# EAGLE design Natcar (EAGLE 9.2.2)
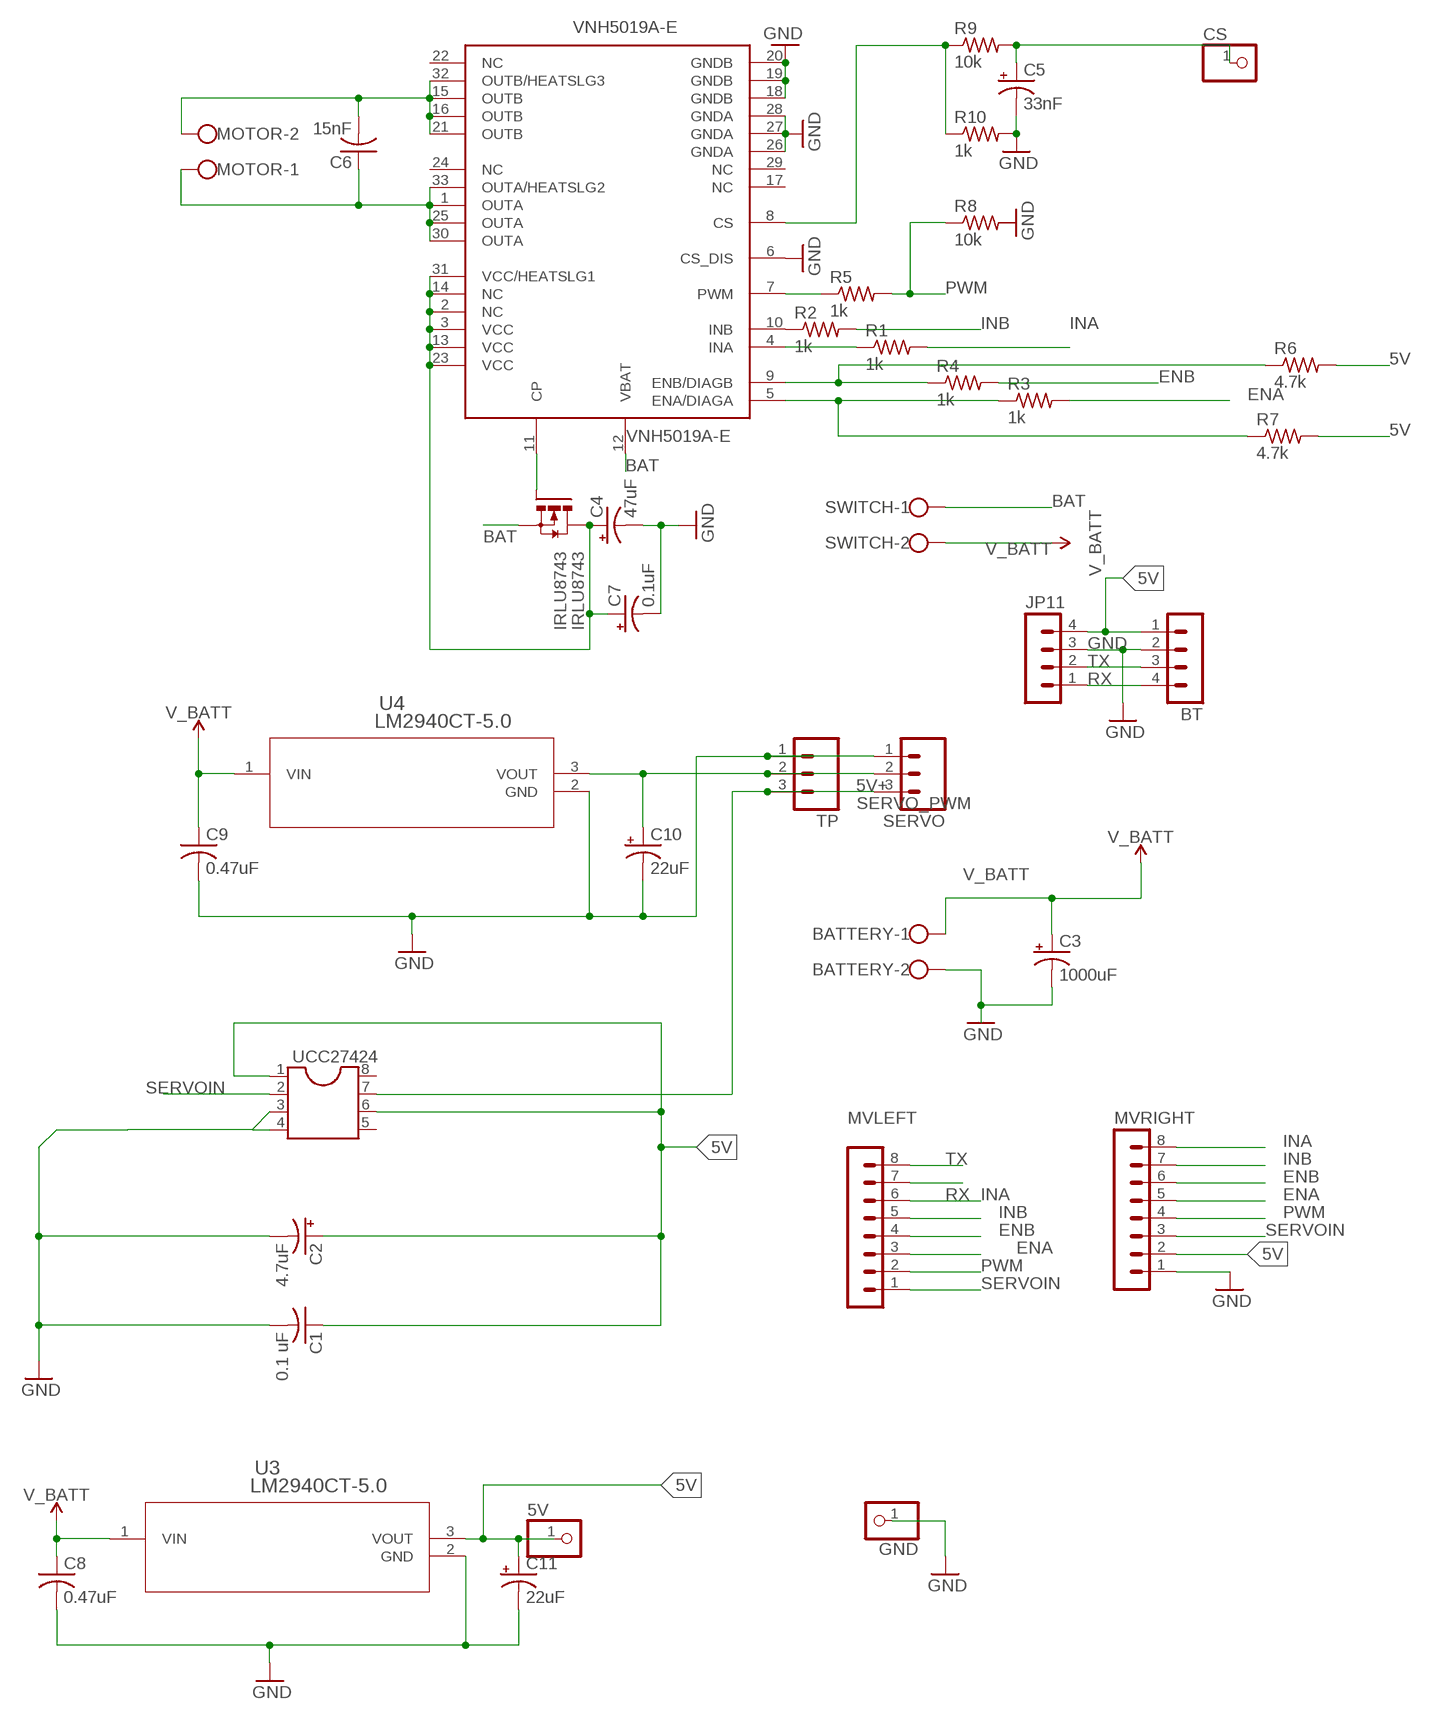
[diagram p0: schematic, sheet 1]

## Parts
5V  PINHD-1X1  [1X01]
BATTERY  W237-102  [W237-102]
BT  MA04-1  [MA04-1]
C1  0.1 uF  C-US025-030X050  [C025-030X050]
C2  4.7uF  CPOL-USE2-5  [E2-5]
C3  1000uF  CPOL-USE5-10.5  [E5-10,5]
C4  47uF  CPOL-USE2.5-5  [E2,5-5]
C5  33nF  CPOL-USE2.5-5  [E2,5-5]
C6  15nF  C-US025-025X050  [C025-025X050]
C7  0.1uF  CPOL-USE2.5-5  [E2,5-5]
C8  0.47uF  C-US025-030X050  [C025-030X050]
C9  0.47uF  C-US025-030X050  [C025-030X050]
C10  22uF  CPOL-USE2.5-5  [E2,5-5]
C11  22uF  CPOL-USE2.5-5  [E2,5-5]
CS  PINHD-1X1  [1X01]
GND  PINHD-1X1  [1X01]
IRLU8743  IRLU8743  [TO251AA-V]
JP11  MA04-1  [MA04-1]
MOTOR  W237-102  [W237-102]
MVLEFT  MA08-1  [MA08-1]
MVRIGHT  MA08-1  [MA08-1]
R1  1k  R-US_0207/7  [0207/7]
R2  1k  R-US_0207/7  [0207/7]
R3  1k  R-US_0207/7  [0207/7]
R4  1k  R-US_0207/7  [0207/7]
R5  1k  R-US_0207/7  [0207/7]
R6  4.7k  R-US_0207/7  [0207/7]
R7  4.7k  R-US_0207/7  [0207/7]
R8  10k  R-US_0207/7  [0207/7]
R9  10k  R-US_0207/7  [0207/7]
R10  1k  R-US_0207/7  [0207/7]
SERVO  MA03  [03P]
SWITCH  W237-102  [W237-102]
TP  MA03  [03P]
U3  LM2940CT-5.0  [T03B]
U4  LM2940CT-5.0  [T03B]
UCC27424  DIL8S  [SOCKET-08]
VNH5019A-E  VNH5019A-E  [MULTIPOWERSO-30]

## Nets
5V: 5V.1 BT.1 C1.1 C2.+ C11.+ JP11.4 MVRIGHT.2 R6.2 R7.2 U3.3(VOUT) UCC27424.1 UCC27424.6
5V+: C10.+ SERVO.2 TP.2 U4.3(VOUT)
BAT: IRLU8743.3(S) SWITCH.1 VNH5019A-E.12(VBAT)
ENA: MVLEFT.3 MVRIGHT.5 R3.2
ENB: MVLEFT.4 MVRIGHT.6 R4.2
GND: BATTERY.2 BT.2 C1.2 C2.- C3.- C4.- C5.- C7.- C8.2 C9.2 C10.- C11.- GND.1 JP11.3 MVRIGHT.1 R10.2 SERVO.1 TP.1 U3.2(GND) U4.2(GND) UCC27424.3 UCC27424.4 VNH5019A-E.6(CS_DIS) VNH5019A-E.18(GNDB) VNH5019A-E.19(GNDB) VNH5019A-E.20(GNDB) VNH5019A-E.26(GNDA) VNH5019A-E.27(GNDA) VNH5019A-E.28(GNDA)
INA: MVLEFT.6 MVRIGHT.8 R1.2
INB: MVLEFT.5 MVRIGHT.7 R2.2
N$1: R9.1 R10.1 VNH5019A-E.8(CS)
N$2: R1.1 VNH5019A-E.4(INA)
N$3: R2.1 VNH5019A-E.10(INB)
N$4: R3.1 R7.1 VNH5019A-E.5(ENA/DIAGA)
N$5: R4.1 R6.1 VNH5019A-E.9(ENB/DIAGB)
N$6: R5.1 VNH5019A-E.7(PWM)
N$8: C5.+ CS.1 R9.2
N$21: IRLU8743.1(G) VNH5019A-E.11(CP)
OUTA [default]: C6.1 MOTOR.1 VNH5019A-E.1(OUTA) VNH5019A-E.25(OUTA) VNH5019A-E.30(OUTA) VNH5019A-E.33(OUTA/HEATSLG2)
OUTB [default]: C6.2 MOTOR.2 VNH5019A-E.15(OUTB) VNH5019A-E.16(OUTB) VNH5019A-E.21(OUTB) VNH5019A-E.32(OUTB/HEATSLG3)
PWM: MVLEFT.2 MVRIGHT.4 R5.2 R8.1
RX: BT.4 JP11.1 MVLEFT.7
SERVO_PWM: SERVO.3 TP.3 UCC27424.7
SERVOIN: MVLEFT.1 MVRIGHT.3 UCC27424.2
TX: BT.3 JP11.2 MVLEFT.8
V_BATT [Power]: BATTERY.1 C3.+ C8.1 C9.1 SWITCH.2 U3.1(VIN) U4.1(VIN)
VCC: C4.+ C7.+ IRLU8743.2(D) VNH5019A-E.2(NC) VNH5019A-E.3(VCC) VNH5019A-E.13(VCC) VNH5019A-E.14(NC) VNH5019A-E.23(VCC) VNH5019A-E.31(VCC/HEATSLG1)
Unconnected: R8.2 UCC27424.5 UCC27424.8 VNH5019A-E.17(NC) VNH5019A-E.22(NC) VNH5019A-E.24(NC) VNH5019A-E.29(NC)

## Library data of the parts
5V CS GND = pinhead:PINHD-1X1: PIN HEADER
BATTERY MOTOR SWITCH = con-wago-500:W237-102: WAGO SCREW CLAMP; MPN: 237-102; OC_FARNELL: unknown; OC_NEWARK: 70K9898
BT JP11 = con-lstb:MA04-1: PIN HEADER; OC_FARNELL: unknown; OC_NEWARK: unknown
C1 = adafruit:C-US: CAPACITOR, American symbol
C2 C3 C10 C11 = adafruit:CPOL-US: POLARIZED CAPACITOR, American symbol
C4 C5 C7 = rcl:CPOL-US: POLARIZED CAPACITOR, American symbol; SPICEPREFIX: C
C6 = resistor:C-US: CAPACITOR, American symbol
C8 C9 = rcl:C-US: CAPACITOR, American symbol; SPICEPREFIX: C
IRLU8743 = irlu8743:IRLU8743
MVLEFT MVRIGHT = con-lstb:MA08-1: PIN HEADER; OC_FARNELL: unknown; OC_NEWARK: unknown
R1-R10 = rcl:R-US_: RESISTOR, American symbol; SPICEPREFIX: R
SERVO TP = con-amp-quick:MA03: AMP QUICK CONNECTOR; OC_FARNELL: unknown; OC_NEWARK: unknown
U3 U4 = lm2940ct:LM2940CT-5.0; MANUFACTURER_PART_NUMBER: LM2940CT5.0; VENDOR: Texas Instruments
UCC27424 = ic-package:DIL8: Dual In Line / Socket
VNH5019A-E = VNH5019A-E:VNH5019A-E

## Net classes
0 Control: width 0.254 mm, drill 0.508 mm, clearance 0.305 mm
1 Power: width 1.016 mm, drill 0.508 mm, clearance 0.305 mm
2 default: width 0.254 mm, drill 0.508 mm, clearance 0.305 mm

## Board
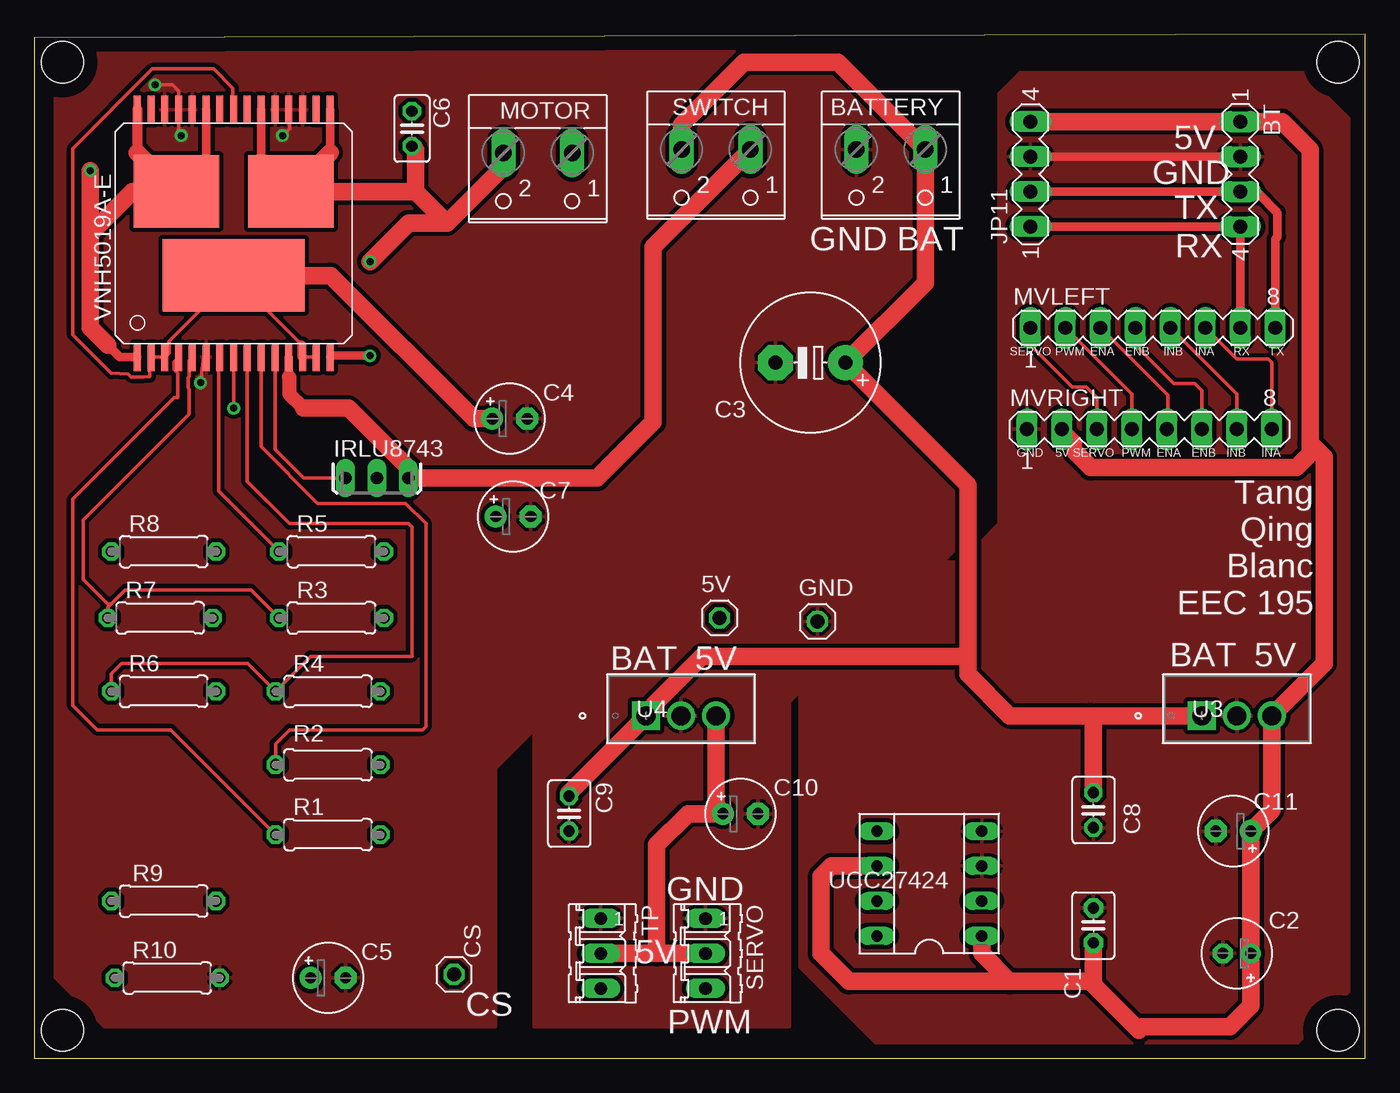
[diagram p1: board, top side]
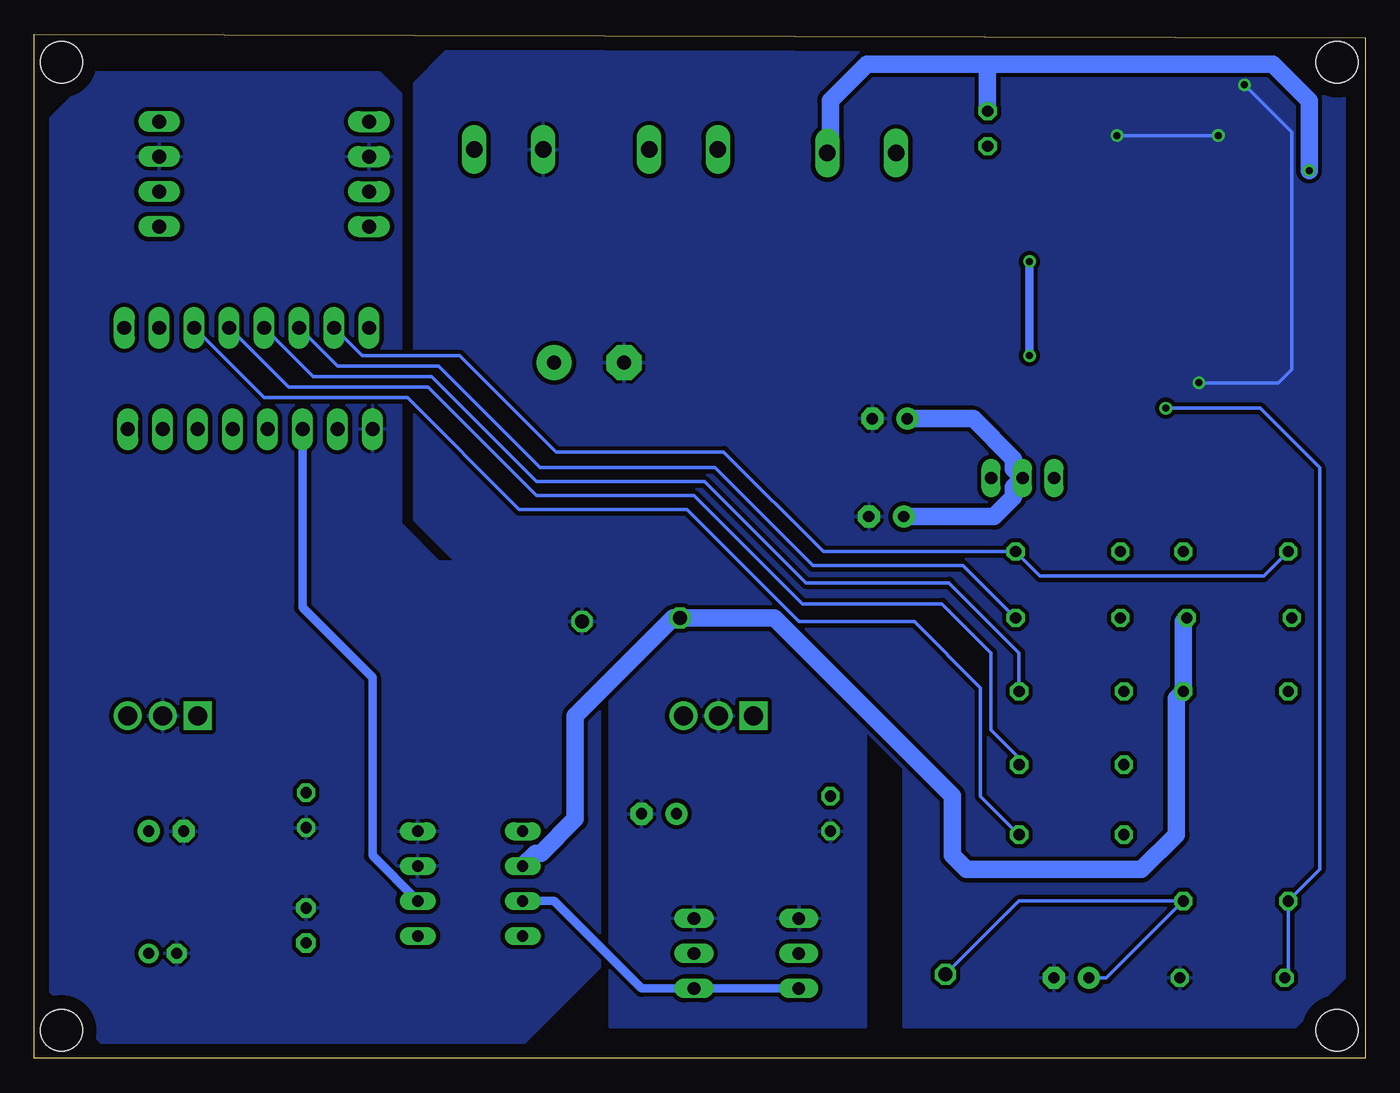
[diagram p2: board, bottom side, seen from below]

Size 96.7 x 74.41 mm. Coordinates in mm from the lower left corner, seen from the top.
Outline: 0,0 96.7,0 96.7,74.41 0,74.16 0,0
Copper layers (1*16): Top 0.035mm / dielectric 1.5mm / Bottom 0.035mm
Design rules "default": minimum track width 6mil, minimum drill 0.35mm, track to track 6mil, track to pad 6mil, pad to pad 6mil, via to via 6mil, smd to smd 6mil, copper to edge 40mil, drill to drill 6mil, minimum pad ring 10mil, minimum via ring 8mil, stop-mask expansion 4mil, vias tented up to drill 0mil, thermal gap 10mil
Holes 3.05 mm at 2.03,72.39 94.74,72.39 94.74,2.03 2.03,2.03

### Footprints (pad centres in the part's own frame; a part is rotated, then mirrored left to right if it is on the bottom)
1X01 = drill 1.016 octagon: 1 0,0
W237-102 = drill 1.194 long: 1 -2.5,-1.27; 2 2.5,-1.27
MA04-1 = drill 1.016 long: 1 -3.81,0; 2 -1.27,0; 3 1.27,0; 4 3.81,0
C025-030X050 = drill 0.813 pad 1.422 octagon: 1 -1.27,0; 2 1.27,0
E2-5 = drill 0.813 pad 1.422: + -1.016,0 | drill 0.813 pad 1.422 octagon: - 1.016,0
E5-10,5 = drill 1.016 pad 2.54: + -2.54,0 | drill 1.016 pad 2.54 octagon: - 2.54,0
E2,5-5 = drill 0.813 pad 1.6: + -1.27,0 | drill 0.813 pad 1.6 octagon: - 1.27,0
C025-025X050 = drill 0.813 octagon: 1 -1.27,0; 2 1.27,0
C025-030X050' = drill 0.813 octagon: 1 -1.27,0; 2 1.27,0
TO251AA-V = drill 0.889 long: 1 -2.286,0; 2 0,0; 3 2.286,0
MA08-1 = drill 1.016 long: 1 -8.89,0; 2 -6.35,0; 3 -3.81,0; 4 -1.27,0; 5 1.27,0; 6 3.81,0; 7 6.35,0; 8 8.89,0
0207/7 = drill 0.813 octagon: 1 -3.81,0; 2 3.81,0
03P = drill 0.914 long: 1 -2.54,0; 2 0,0; 3 2.54,0
T03B = drill 1.372 pad 1.88 square: 1 -5.08,-1.016 | drill 1.372 pad 1.88: 2 -2.54,-1.016; 3 0,-1.016
SOCKET-08 = drill 0.813 long: 1 -3.81,-3.81; 2 -1.27,-3.81; 3 1.27,-3.81; 4 3.81,-3.81; 5 3.81,3.81; 6 1.27,3.81; 7 -1.27,3.81; 8 -3.81,3.81
MULTIPOWERSO-30 = smd 0.508 x 2: 1 -7,-9; 2 -6,-9; 3 -5,-9; 4 -4,-9; 5 -3,-9; 6 -2,-9; 7 -1,-9; 8 0,-9; 9 1,-9; 10 2,-9; 11 3,-9; 12 4,-9; 13 5,-9; 14 6,-9; 15 7,-9; 16 7,9; 17 6,9; 18 5,9; 19 4,9; 20 3,9; 21 2,9; 22 1,9; 23 0,9; 24 -1,9; 25 -2,9; 26 -3,9; 27 -4,9; 28 -5,9; 29 -6,9; 30 -7,9 | smd 10.3 x 5.25: 31 0,-3.05 | smd 6.23 x 5.25: 32 4.165,3.05; 33 -4.165,3.05

### Placement (x,y rotation side)
5V  49.78,32 0 top
BATTERY  62.23,64.77 180 top
BT  87.63,64.26 270 top
C1  76.96,9.65 90 top
C2  87.38,7.62 180 top
C3  56.39,50.55 180 top
C4  34.54,46.48 0 top
C5  21.34,5.84 0 top
C6  27.43,67.56 270 top
C7  34.8,39.37 0 top
C8  0.47uF  [C025-030X050']  76.96,18.03 270 top
C9  0.47uF  [C025-030X050']  38.86,17.78 270 top
C10  51.31,17.78 0 top
C11  87.12,16.51 180 top
CS  30.48,6.1 0 top
GND  56.9,31.75 0 top
IRLU8743  24.89,42.16 0 top
JP11  72.39,64.26 90 top
MOTOR  36.58,64.52 180 top
MVLEFT  81.28,53.09 0 top
MVRIGHT  81.03,45.72 0 top
R1  21.34,16.26 0 top
R2  21.34,21.34 0 top
R3  21.59,32 0 top
R4  21.34,26.67 0 top
R5  21.59,36.83 0 top
R6  9.4,26.67 0 top
R7  9.14,32 0 top
R8  9.4,36.83 0 top
R9  9.4,11.43 0 top
R10  9.65,5.84 0 top
SERVO  48.77,7.62 270 top
SWITCH  49.53,64.77 180 top
TP  41.15,7.62 270 top
U3  89.92,25.91 0 top
U4  49.53,25.91 0 top
UCC27424  65.02,12.7 90 top
VNH5019A-E  14.48,59.94 0 top

### Tracks (layer width: path | path; a pad name or v marks a point on that pad's centre or on a via)
5V
  Top 1.016: 75.64,44.05 75.64,44.76 MVRIGHT.2
  Top 1.27: JP11.4 BT.1 90.68,68.07 92.71,66.04 92.71,44.7 | 92.71,44.7 92.71,43.94 91.69,42.93 76.77,42.93 75.64,44.05 | 92.71,44.7 93.73,43.69 93.73,28.7 U3.3 89.92,18.03 C11.+ C2.+ 88.39,3.81 86.87,2.29 80.52,2.29 80.26,2.03 76.96,5.33 | 76.96,5.33 C1.1 | 76.96,5.33 76.71,5.59 70.87,5.59 | 70.87,5.59 68.83,7.62 UCC27424.1 | 70.87,5.59 59.18,5.59 57.15,7.62 57.15,13.21 57.91,13.97 UCC27424.6
  Bottom 1.27: UCC27424.6 60.27,14.91 59.89,14.91 57.4,17.4 57.4,24.89 50.29,32 5V.1 42.91,32 29.97,19.07 29.97,14.73 28.96,13.72 16.26,13.72 13.72,16.26 13.72,26.16 R6.2 13.21,31.75 R7.2
5V+
  Top 1.27: SERVO.2 45.21,7.62 | U4.3 49.53,18.29 C10.+ 47.5,17.78 45.21,15.49 45.21,7.62 | 45.21,7.62 TP.2
BAT
  Top 0.61: VNH5019A-E.12 18.48,49.54
  Top 1.016: 19.56,47.24 18.52,48.28 18.52,49.5 18.48,49.54
  Top 1.27: SWITCH.1 44.96,58.97 44.96,46.23 40.89,42.16 IRLU8743.3 27.18,42.89 22.83,47.24 19.56,47.24
ENA
  Top 0.254: MVLEFT.3 82.35,48.21 82.35,45.77 MVRIGHT.5
  Bottom 0.254: MVLEFT.3 74.68,50.29 67.31,50.29 59.94,42.93 47.24,42.93 40.13,35.81 29.21,35.81 R3.2
ENB
  Top 0.254: MVLEFT.4 80.01,51.82 82.8,49.02 84.33,49.02 84.84,48.51 MVRIGHT.6
  Bottom 0.254: MVLEFT.4 76.45,49.53 67.82,49.53 60.2,41.91 48.01,41.91 40.64,34.54 30.23,34.54 25.15,29.46 R4.2
GND  (via drill 0.51)
  Top 0.254: v8.76,70.74 10.03,70.74 10.48,70.29 VNH5019A-E.27 10.48,67.25 v10.67,67.06 | v12.06,49.1 12.27,50.73 VNH5019A-E.6 | v18.03,67.06 18.54,67.56 18.54,68.88 VNH5019A-E.19
  Top 0.61: BT.2 JP11.3
  Bottom 0.254: v8.76,70.74 5.33,67.31 5.33,50.04 6.3,49.07 12.06,49.07 | 12.06,49.07 | 12.06,49.07 v12.06,49.1 | v10.67,67.06 v18.03,67.06
  pour Top: 4.57,73.15 1.52,70.1 1.52,5.84 5.08,2.29 5.33,2.29 33.53,2.29 33.53,21.08 36.58,24.13 42.67,30.23 60.2,30.23 69.09,39.12 69.09,70.87 66.8,73.15
  pour Bottom: 4.57,73.15 1.52,70.1 1.52,5.84 5.08,2.29 33.53,2.29 33.53,21.08 42.67,30.23 60.2,30.23 69.09,39.12 69.09,70.87 66.8,73.15
  pour Top: 36.32,2.29 54.86,2.29 54.86,25.91 55.12,26.16 60.2,31.24 60.2,36.83 48.26,36.83 36.32,24.89
  pour Bottom: 36.32,2.29 54.86,2.29 54.86,25.91 60.2,31.24 60.2,36.83 48.26,36.83 36.32,24.89
  pour Top: 92.2,71.63 71.63,71.63 70.1,70.1 70.1,38.86 68.58,37.34 67.31,36.07 48.77,36.07 46.99,34.29 46.99,30.99 48.26,29.72 55.63,29.72 55.63,6.6 60.96,1.27 61.47,0.76 91.44,0.76 95.5,4.83 95.5,67.31 95.5,68.33
  pour Bottom: 71.63,71.63 70.1,70.1 70.1,38.86 67.31,36.07 48.77,36.07 46.99,34.29 46.99,30.99 48.26,29.72 55.63,29.72 55.63,6.6 61.47,0.76 91.44,0.76 95.5,4.83 95.5,68.33 92.2,71.63
INA
  Top 0.254: MVLEFT.6 87.38,50.8 89.66,50.8 89.92,50.55 MVRIGHT.8
  Bottom 0.254: MVLEFT.6 80.01,48.01 69.6,48.01 61.47,39.88 49.28,39.88 41.15,31.75 32.77,31.75 27.94,26.92 27.94,19.05 R1.2
INB
  Top 0.254: MVRIGHT.7 87.38,48.26 MVLEFT.5
  Bottom 0.254: MVLEFT.5 78.23,48.77 68.07,48.77 60.2,40.89 48.77,40.89 40.89,33.02 30.73,33.02 27.18,29.46 27.18,23.88 25.15,21.84 R2.2
N$1  (via drill 0.51)
  Top 0.254: VNH5019A-E.8 v14.48,47.24
  Bottom 0.254: v14.48,47.24 7.62,47.24 3.3,42.93 3.3,13.72 R9.1 5.59,6.1 R10.1
N$2
  Top 0.254: VNH5019A-E.4 10.16,50.63 10.16,50.04 10.41,49.79 10.41,48.01 10.16,48.01 2.79,40.64 2.79,25.65 4.57,23.88 9.91,23.88 R1.1
N$3
  Top 0.254: R2.1 17.53,22.86 18.54,23.88 28.19,23.88 28.45,24.13 28.45,38.86 26.98,40.34 20.6,40.34 16.48,44.45 VNH5019A-E.10
N$4
  Top 0.254: VNH5019A-E.5 11.26,50.72 11.26,49.55 11.18,49.47 11.18,48.73 11.26,48.65 11.26,46.81 3.56,39.12 3.56,34.8 5.33,33.02 5.59,33.02 | R3.1 15.75,34.04 6.6,34.04 5.59,33.02 | 5.59,33.02 5.33,32.77 R7.1
N$5
  Top 0.254: R6.1 5.59,27.94 6.35,28.7 15.49,28.7 R4.1 20.07,29.21 27.43,29.21 27.43,38.61 27.18,38.86 18.54,38.86 15.48,41.93 VNH5019A-E.9
N$6
  Top 0.254: VNH5019A-E.7 13.4,50.86 13.4,41.21 R5.1
N$8
  Bottom 0.254: CS.1 25.15,11.43 R9.2 18.8,5.84 C5.+
N$21
  Top 0.254: VNH5019A-E.11 17.48,44.24 19.56,42.16 IRLU8743.1
OUTA  (via drill 0.51)
  Top 0.61: VNH5019A-E.25 12.48,65.16 | 5.33,51.82 6.21,50.94 VNH5019A-E.1
  Top 0.711: VNH5019A-E.30 7.48,65.83
  Top 1.016: 12.48,65.16 VNH5019A-E.33
  Top 1.27: 7.48,65.83 VNH5019A-E.33 7.11,62.99 4.06,59.94 | 5.33,51.82 4.06,53.09 4.06,59.94 | 4.06,59.94 v4.06,64.52
  Bottom 1.27: v4.06,64.52 4.06,69.6 6.72,72.25 27.43,72.25 | MOTOR.1 38.86,66 38.86,69.6 36.2,72.25 27.43,72.25 | 27.43,72.25 C6.1
OUTB  (via drill 0.51)
  Top 0.61: VNH5019A-E.16 21.48,65.83 | VNH5019A-E.21 16.48,65.16 | VNH5019A-E.15 21.59,51.05 v24.38,51.05
  Top 1.016: VNH5019A-E.32
  Top 1.27: 21.48,65.83 VNH5019A-E.32 27.69,62.99 | 16.48,65.16 VNH5019A-E.32 | 27.69,62.99 29.97,60.71 | 29.97,60.71 27.18,60.71 v24.38,57.91 | 29.97,60.71 34.08,64.81 MOTOR.2 | 27.69,62.99 27.69,66.04 C6.2
  Bottom 0.61: v24.38,51.05 v24.38,57.91
PWM
  Top 0.254: MVLEFT.2 79.76,48.26 MVRIGHT.4
  Bottom 0.254: MVLEFT.2 72.9,51.05 65.79,51.05 58.8,44.07 46.61,44.07 39.37,36.83 R5.2 23.62,35.05 7.37,35.05 R8.1
RX
  Top 0.61: JP11.1 BT.4 MVLEFT.7
SERVO_PWM
  Bottom 0.61: TP.3 SERVO.3 52.58,5.08 58.93,11.43 UCC27424.7
SERVOIN
  Top 0.254: MVLEFT.1 72.39,51.82 75.44,48.77 76.45,48.77 77.22,48.01 MVRIGHT.3
  Bottom 0.61: MVRIGHT.3 77.22,32.77 72.14,27.69 72.14,14.73 UCC27424.2
TX
  Top 0.254: 87.63,62.9 BT.3
  Top 0.61: BT.3 JP11.2 | MVLEFT.8 90.17,59.53 90.32,59.68 90.32,61.47 88.89,62.9 87.63,62.9
V_BATT
  Top 1.27: SWITCH.2 47.03,67.86 51.56,72.39 58.38,72.39 BATTERY.1 64.73,56.35 C3.+ 67.82,41.66 67.82,29.21 | 67.82,29.21 67.82,27.94 70.87,24.89 76.71,24.89 | 76.71,24.89 U3.1 | 76.71,24.89 76.96,24.64 C8.1 | C9.1 38.86,19.3 U4.1 45.02,25.46 45.02,25.71 48.52,29.21 67.82,29.21
VCC
  Top 0.254: VNH5019A-E.14 VNH5019A-E.13 19.43,50.99 | 14.48,56.81 VNH5019A-E.31 | 14.48,56.81 9.79,52.12 9.79,51.26 VNH5019A-E.3 VNH5019A-E.2 8.35,50.82 8.38,49.53 7.91,49.51 7.04,49.51 6.82,49.74 5.59,49.78 2.79,52.58 2.79,66.12 8.57,71.9 13.02,71.9 14.42,70.5 14.42,69 VNH5019A-E.23 | 19.43,51.86 14.48,56.81
  Top 0.61: 19.43,51.86 19.43,50.99
  Top 1.27: VNH5019A-E.31 21.52,56.89 31.93,46.48 C4.+
  Bottom 1.27: C7.+ 26.96,39.37 25.54,40.79 25.54,41.52 IRLU8743.2 25.54,42.81 25.54,43.54 28.48,46.48 C4.+

### Text on the board
tNames: 5V | GND | TX | GND | BAT | RX | SERVO | PWM | ENA | ENB | INB | INA | RX | TX | GND | 5V | SERVO | PWM | ENA | ENB | INB | INA | Tang / Qing / Blanc / EEC 195 | BAT | 5V | BAT | 5V | GND | 5V | CS | PWM